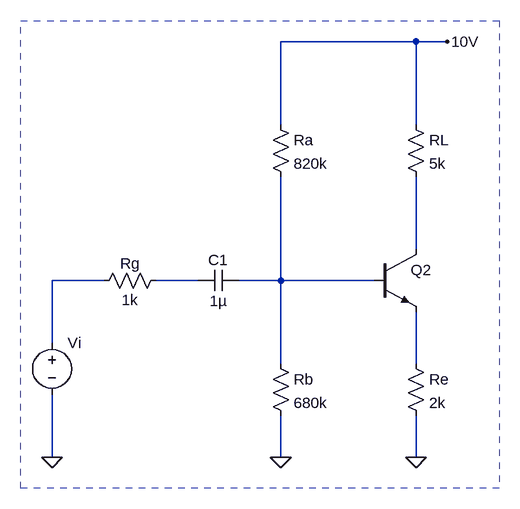
[diagram p0: schematic Ej 1.10b.asc]
Ej 1.10b.asc, the LTspice schematic file:
Version 4
SHEET 1 7076 6404
WIRE 1472 48 1264 48
WIRE 1520 48 1472 48
WIRE 1264 176 1264 48
WIRE 1472 176 1472 48
WIRE 1472 368 1472 256
WIRE 992 416 912 416
WIRE 1136 416 1072 416
WIRE 1264 416 1264 256
WIRE 1264 416 1200 416
WIRE 1408 416 1264 416
WIRE 912 512 912 416
WIRE 1264 544 1264 416
WIRE 1472 544 1472 464
WIRE 912 688 912 592
WIRE 1264 688 1264 624
WIRE 1472 688 1472 624
FLAG 912 688 0
FLAG 1520 48 10V
FLAG 1472 688 0
FLAG 1264 688 0
SYMBOL npn 1408 368 R0
WINDOW 3 56 68 Invisible 2
SYMATTR InstName Q2
SYMBOL res 976 432 R270
WINDOW 0 27 56 VTop 2
WINDOW 3 2 56 VBottom 2
SYMATTR InstName Rg
SYMATTR Value 1k
SYMBOL voltage 912 496 R0
WINDOW 3 24 96 Invisible 2
SYMATTR InstName Vi
SYMBOL res 1456 160 R0
SYMATTR InstName RL
SYMATTR Value 5k
SYMBOL res 1456 528 R0
SYMATTR InstName Re
SYMATTR Value 2k
SYMBOL res 1248 528 R0
SYMATTR InstName Rb
SYMATTR Value 680k
SYMBOL res 1248 160 R0
SYMATTR InstName Ra
SYMATTR Value 820k
SYMBOL cap 1136 432 R270
WINDOW 0 32 32 VTop 2
WINDOW 3 0 32 VBottom 2
SYMATTR InstName C1
SYMATTR Value 1µ
RECTANGLE Normal 1600 736 864 16 2

The netlist it stands for:
* Ej 1.10b.asc
Q2 N001 N004 N005 0 NPN
Rg N002 N003 1k
Vi N002 0 V
RL 10V N001 5k
Re N005 0 2k
Rb N004 0 680k
Ra 10V N004 820k
C1 N003 N004 1µ
.model NPN NPN
.model PNP PNP
.lib standard.bjt
.backanno
.end